# Altium schematic sheet MB_CPU_memory.SchDoc
size A4
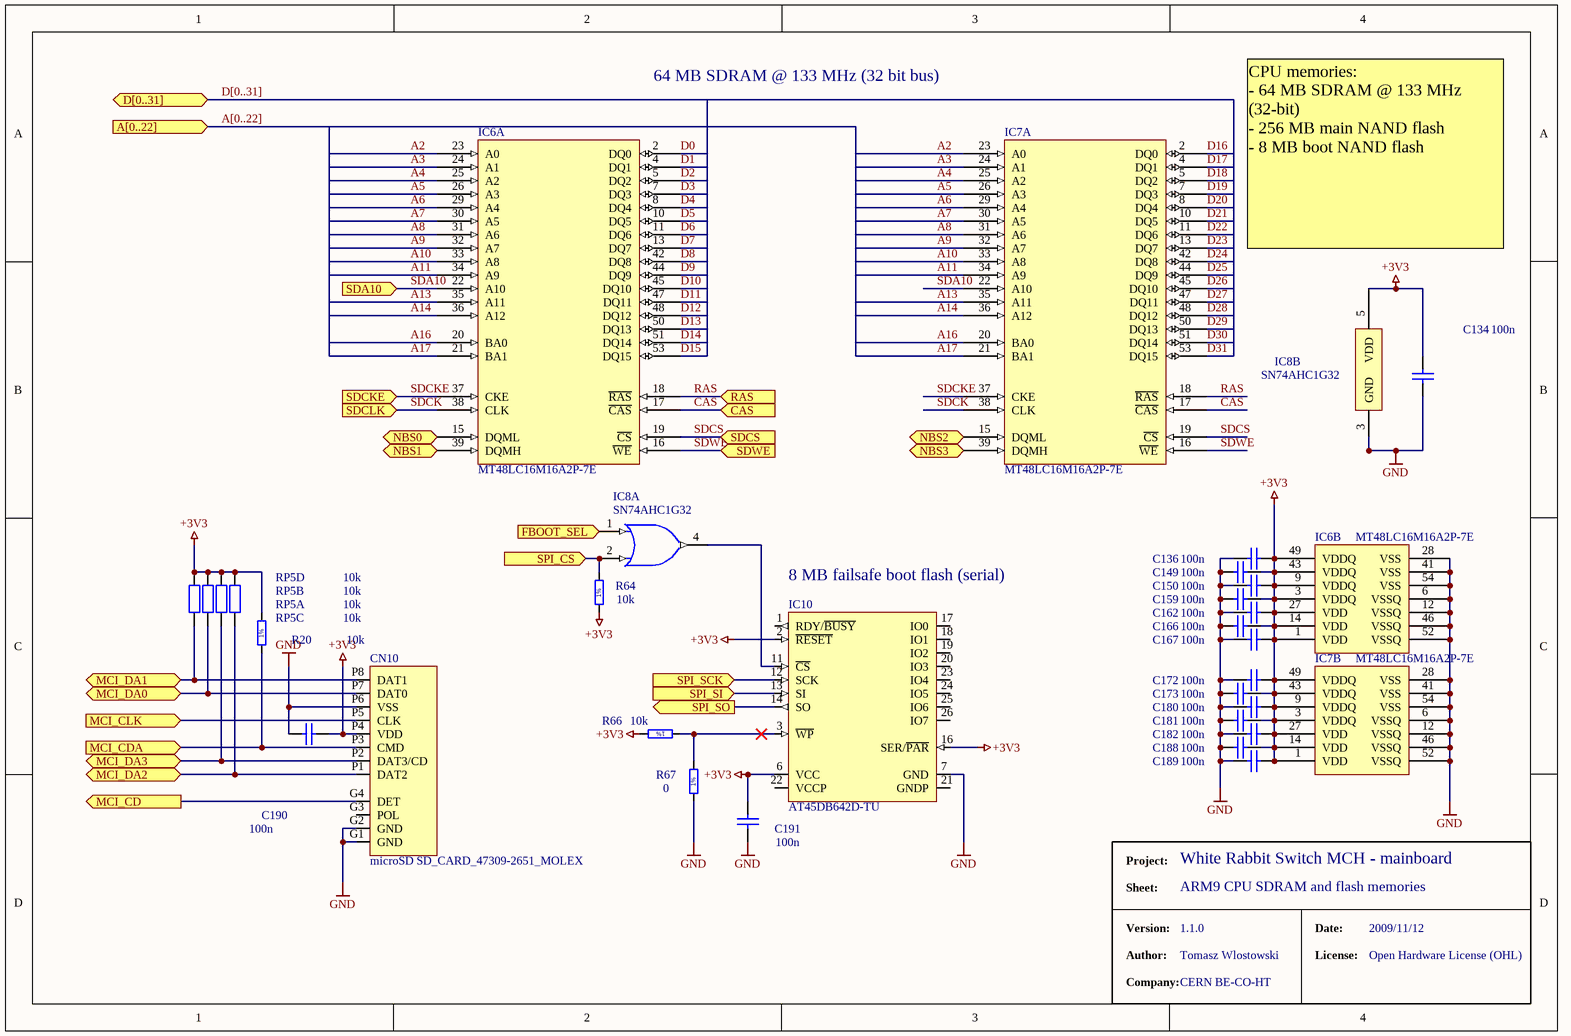
[diagram p0: MB_CPU_memory.SchDoc]

## Parts
C134  100n  [CAPC1005X55N]
C136  100n  [CAPC1005X55N]
C149  100n  [CAPC1005X55N]
C150  100n  [CAPC1005X55N]
C159  100n  [CAPC1005X55N]
C162  100n  [CAPC1005X55N]
C166  100n  [CAPC1005X55N]
C167  100n  [CAPC1005X55N]
C172  100n  [CAPC1005X55N]
C173  100n  [CAPC1005X55N]
C180  100n  [CAPC1005X55N]
C181  100n  [CAPC1005X55N]
C182  100n  [CAPC1005X55N]
C188  100n  [CAPC1005X55N]
C189  100n  [CAPC1005X55N]
C190  100n  [CAPC1005X55N]
C191  100n  [CAPC1005X55N]
CN10  microSD SD_CARD_47309-2651_MOLEX  [SD_CARD_47309-2651_MOLEX]
IC6  value MT48LC16M16A2P-7E  [TSOP54]  (hidden comment: MT48LC16M16A2TG)  (parts A,B of 2)
IC7  value MT48LC16M16A2P-7E  [TSOP54]  (hidden comment: MT48LC16M16A2TG)  (parts A,B of 2)
IC8  SN74AHC1G32  [SOT23-5AL]  (parts A,B of 2)
IC10  value AT45DB642D-TU  [TSOP28-1]  (hidden comment: AT45DB642)
R20  10k  [RESC1608X55N]
R64  10k  [RESC1005X40N]
R66  10k  [RESC1005X40N]
R67  0  [RESC1005X40N]
RP5  value 10k  [YC124]  (hidden comment: 10k 0804)  (parts A,B,C,D of 4)

## Ports
A[0..22] (in), CAS (in), D[0..31] (bidir), FBOOT_SEL (in), MCI_CD (out), MCI_CDA (in), MCI_CLK (in), MCI_DA0 (bidir), MCI_DA1 (bidir), MCI_DA2 (bidir), MCI_DA3 (bidir), NBS0 (in), NBS1 (in), NBS2 (in), NBS3 (in), RAS (in), SDA10 (in), SDCKE (in), SDCLK (in), SDCS (in), SDWE (in), SPI_CS (in), SPI_SCK (in), SPI_SI (in), SPI_SO (out)

## Nets
+3V3: C134.1 C136.2 C149.2 C150.2 C159.2 C162.2 C166.2 C167.2 C172.2 C173.2 C180.2 C181.2 C182.2 C188.2 C189.2 C190.2 C191.2 CN10.P4(VDD) IC6.1(VDD) IC6.3(VDDQ) IC6.9(VDDQ) IC6.14(VDD) IC6.27(VDD) IC6.43(VDDQ) IC6.49(VDDQ) IC7.1(VDD) IC7.3(VDDQ) IC7.9(VDDQ) IC7.14(VDD) IC7.27(VDD) IC7.43(VDDQ) IC7.49(VDDQ) IC8.5(VDD) IC10.2(~{RESET}) IC10.6(VCC) IC10.16(SER/~{PAR}) R20.2 R64.1 R66.2 RP5.5(B) RP5.6(B) RP5.7(B) RP5.8(B)
GND: C134.2 C136.1 C149.1 C150.1 C159.1 C162.1 C166.1 C167.1 C172.1 C173.1 C180.1 C181.1 C182.1 C188.1 C189.1 C190.1 C191.1 CN10.G1(GND) CN10.G2(GND) CN10.P6(VSS) IC6.6(VSSQ) IC6.12(VSSQ) IC6.28(VSS) IC6.41(VSS) IC6.46(VSSQ) IC6.52(VSSQ) IC6.54(VSS) IC7.6(VSSQ) IC7.12(VSSQ) IC7.28(VSS) IC7.41(VSS) IC7.46(VSSQ) IC7.52(VSSQ) IC7.54(VSS) IC8.3(GND) IC10.7(GND) R67.1
A2: IC6.23(A0) IC7.23(A0)
A3: IC6.24(A1) IC7.24(A1)
A4: IC6.25(A2) IC7.25(A2)
A5: IC6.26(A3) IC7.26(A3)
A6: IC6.29(A4) IC7.29(A4)
A7: IC6.30(A5) IC7.30(A5)
A8: IC6.31(A6) IC7.31(A6)
A9: IC6.32(A7) IC7.32(A7)
A10: IC6.33(A8) IC7.33(A8)
A11: IC6.34(A9) IC7.34(A9)
A13: IC6.35(A11) IC7.35(A11)
A14: IC6.36(A12) IC7.36(A12)
A16: IC6.20(BA0) IC7.20(BA0)
A17: IC6.21(BA1) IC7.21(BA1)
CAS: IC6.17(~{CAS}) IC7.17(~{CAS}) ; port CAS
D0: IC6.2(DQ0)
D1: IC6.4(DQ1)
D2: IC6.5(DQ2)
D3: IC6.7(DQ3)
D4: IC6.8(DQ4)
D5: IC6.10(DQ5)
D6: IC6.11(DQ6)
D7: IC6.13(DQ7)
D8: IC6.42(DQ8)
D9: IC6.44(DQ9)
D10: IC6.45(DQ10)
D11: IC6.47(DQ11)
D12: IC6.48(DQ12)
D13: IC6.50(DQ13)
D14: IC6.51(DQ14)
D15: IC6.53(DQ15)
D16: IC7.2(DQ0)
D17: IC7.4(DQ1)
D18: IC7.5(DQ2)
D19: IC7.7(DQ3)
D20: IC7.8(DQ4)
D21: IC7.10(DQ5)
D22: IC7.11(DQ6)
D23: IC7.13(DQ7)
D24: IC7.42(DQ8)
D25: IC7.44(DQ9)
D26: IC7.45(DQ10)
D27: IC7.47(DQ11)
D28: IC7.48(DQ12)
D29: IC7.50(DQ13)
D30: IC7.51(DQ14)
D31: IC7.53(DQ15)
FBOOT_SEL: IC8.1(A) ; port FBOOT_SEL
MCI_CD: CN10.G4(DET) ; port MCI_CD
MCI_CDA: CN10.P3(CMD) R20.1 ; port MCI_CDA
MCI_CLK: CN10.P5(CLK) ; port MCI_CLK
MCI_DA0: CN10.P7(DAT0) RP5.2(A) ; port MCI_DA0
MCI_DA1: CN10.P8(DAT1) RP5.4(A) ; port MCI_DA1
MCI_DA2: CN10.P1(DAT2) RP5.1(A) ; port MCI_DA2
MCI_DA3: CN10.P2(DAT3/CD) RP5.3(A) ; port MCI_DA3
NBS0: IC6.15(DQML) ; port NBS0
NBS1: IC6.39(DQMH) ; port NBS1
NBS2: IC7.15(DQML) ; port NBS2
NBS3: IC7.39(DQMH) ; port NBS3
RAS: IC6.18(~{RAS}) IC7.18(~{RAS}) ; port RAS
SDA10: IC6.22(A10) IC7.22(A10) ; port SDA10
SDCK: IC6.38(CLK) IC7.38(CLK) ; port SDCLK
SDCKE: IC6.37(CKE) IC7.37(CKE) ; port SDCKE
SDCS: IC6.19(~{CS}) IC7.19(~{CS}) ; port SDCS
SDWE: IC6.16(~{WE}) IC7.16(~{WE}) ; port SDWE
SPI_CS: IC8.2(B) R64.2 ; port SPI_CS
SPI_SCK: IC10.12(SCK) ; port SPI_SCK
SPI_SI: IC10.13(SI) ; port SPI_SI
SPI_SO: IC10.14(SO) ; port SPI_SO
NetIC8_4: IC8.4(Y) IC10.11(~{CS})
NetIC10_3: IC10.3(~{WP}) R66.1 R67.2

Not connected (* = marked no-connect by the designer): CN10 G3(POL); IC10 1(RDY/~{BUSY}) 17(IO0) 18(IO1) 19(IO2) 20(IO3) 21(GNDP) 22(VCCP) 23(IO4) 24(IO5) 25(IO6) 26(IO7)

## Buses and harness runs
bus A[0..22] = port A[0..22]
bus D[0..31] = port D[0..31]

## Notes on the sheet
- 64 MB SDRAM @ 133 MHz (32 bit bus)
- CPU memories:
  - 64 MB SDRAM @ 133 MHz (32-bit)
  - 256 MB main NAND flash
  - 8 MB boot NAND flash
- (near IC10) 8 MB failsafe boot flash (serial)
- Project:
- Sheet:
- ARM9 CPU SDRAM and flash memories
- White Rabbit Switch MCH - mainboard
- Version:
- Author:
- Company:
- 1.1.0
- Tomasz Wlostowski
- CERN BE-CO-HT
- Date:
- License:
- 2009/11/12
- Open Hardware License (OHL)
- (in symbol R0402_0R_JUMPER) 1%
- (in symbol R0402_10K_1%_0.0625W_100PPM) 1%
- (in symbol R0603_10K_1%_0.1W_100PPM) 1%

## Library data of the parts
C134 C136 C149 C150 C159 C162 C166 C167 C172 C173 C180-C182 C188-C191 = CC0402_100NF_16V_10%_X7R: Non-polarised capacitor; Part Description: SMD Multilayer Chip Ceramic Capacitor; Manufacturer: GENERIC; Manufacturer1 Part Number: 223878715649; Manufacturer1 Datasheet: \\cern.ch\dfs\Applications\Altium\Datasheets\CC0402_X7R_PHYCOMP.pdf; Value: 100nF; Voltage: 16V; TC: X7R; Tolerance: ±10%; Table: Capacitors SMD; Part Number: CC0402_100NF_16V_10%_X7R; Component Kind: Standard; Component Type: Standard; Designator: Capacitor - non polarized; Library Reference: Capacitor - non polarized; Pin Count: 2; Status: Not Recommended; Manufacturer Part Number: CC0402_100NF_16V_10%_X7R; Case: 0402; Mounted: Yes; Socket: No; SMD: Yes; Manufacturer1 Example: PHYCOMP; Manufacturer1 ComponentHeight: 0.55mm; HelpURL: \\cern.ch\dfs\Applications\Altium\Datasheets\CC0402_X7R_PHYCOMP.pdf; Author: CERN DEM JLC; CreateDate: 12/3/2007; LatestRevisionDate: 12/3/2007
CN10 = CON_CARD_micro_SD: Secure Digital Cards socket (Farnell); Value: SD_CARD_47309-2651_MOLEX
IC6 IC7 = MT48LC16M16A2TG: Micron 256Mbit PC133 SDRAM w/16-bit data bus; RefId: 1216281; Supplier: Farnell
IC8 = SN74AHC1G32: TI single OR gate; RefId: SN74AHC1G32DBVT-ND; Value: SN74AHC1G32DBVT-ND; Supplier: Digikey
IC10 = MEM_AT45DB642: serial data FLASH; RefId: 1095799; Supplier: Farnell
R20 = R0603_10K_1%_0.1W_100PPM: Resistor - 1%; Part Description: General Purpose Thick Film Chip Resistor; Manufacturer: GENERIC; Manufacturer1 Part Number: NRC06F1002TRF; Manufacturer1 Datasheet: \\cern.ch\dfs\Applications\Altium\Datasheets\R0603_NIC_NRC.pdf; Power: 0.1W; TC: ±100ppm/°C; Table: Resistors SMD; Part Number: R0603_10K_1%_0.1W_100PPM; Component Kind: Standard; Component Type: Standard; Designator: Resistor - 1%; Library Reference: Resistor - 1%; Pin Count: 2; Value: 10k; Status: Preferred; Tolerance: ±1%; Manufacturer Part Number: R0603_10K_1%_0.1W_100PPM; Case: 0603; Mounted: Yes; Socket: No; SMD: Yes; Manufacturer1 Example: NIC COMPONENT; Manufacturer1 ComponentHeight: 0.55mm; HelpURL: \\cern.ch\dfs\Applications\Altium\Datasheets\R0603_NIC_NRC.pdf; Author: CERN DEM JLC; CreateDate: 2007-12-03; LatestRevisionDate: 2008-03-13
R64 R66 = R0402_10K_1%_0.0625W_100PPM: Resistor - 1%; Part Description: General Purpose Thick Film Chip Resistor; Manufacturer: GENERIC; Manufacturer1 Part Number: 232270671003; Manufacturer1 Datasheet: \\cern.ch\dfs\Applications\Altium\Datasheets\R0402_Phycomp_RC0402.pdf; TC: ±100ppm/°C; Table: Resistors SMD; Part Number: R0402_10K_1%_0.0625W_100PPM; Component Kind: Standard; Component Type: Standard; Designator: Resistor - 1%; Library Reference: Resistor - 1%; Pin Count: 2; Value: 10k; Status: Not recommended; Power: 0.0625W; Tolerance: ±1%; Manufacturer Part Number: R0402_10K_1%_0.0625W_100PPM; Case: 0402; Mounted: Yes; Socket: No; SMD: Yes; Manufacturer1 Example: PHYCOMP; Manufacturer1 ComponentHeight: 0.4mm; HelpURL: \\cern.ch\dfs\Applications\Altium\Datasheets\R0402_Phycomp_RC0402.pdf; Author: CERN DEM JLC; CreateDate: 12/3/2007; LatestRevisionDate: 3/13/2008
R67 = R0402_0R_JUMPER: Resistor - 1%; Part Description: 1A (0.05R Max DC Resistance) Zero Ohm Jumper; Manufacturer: GENERIC; Manufacturer1 Part Number: 232270591001; Manufacturer1 Datasheet: \\cern.ch\dfs\Applications\Altium\Datasheets\R0402_Phycomp_RC0402.pdf; Table: Resistors SMD; Part Number: R0402_0R_JUMPER; Component Kind: Standard; Component Type: Standard; Designator: Resistor - 1%; Library Reference: Resistor - 1%; Pin Count: 2; Value: 0; Status: Not recommended; Manufacturer Part Number: R0402_0R_JUMPER; Case: 0402; Mounted: Yes; Socket: No; SMD: Yes; Manufacturer1 Example: PHYCOMP; Manufacturer1 ComponentHeight: 0.4mm; HelpURL: \\cern.ch\dfs\Applications\Altium\Datasheets\R0402_Phycomp_RC0402.pdf; Author: CERN DEM JLC; CreateDate: 12/3/2007; LatestRevisionDate: 3/13/2008
RP5 = Res_Pack4_10k_YC124: 4-resistor pack; RefId: AVX  CRB2A4 series; Supplier: Farnell